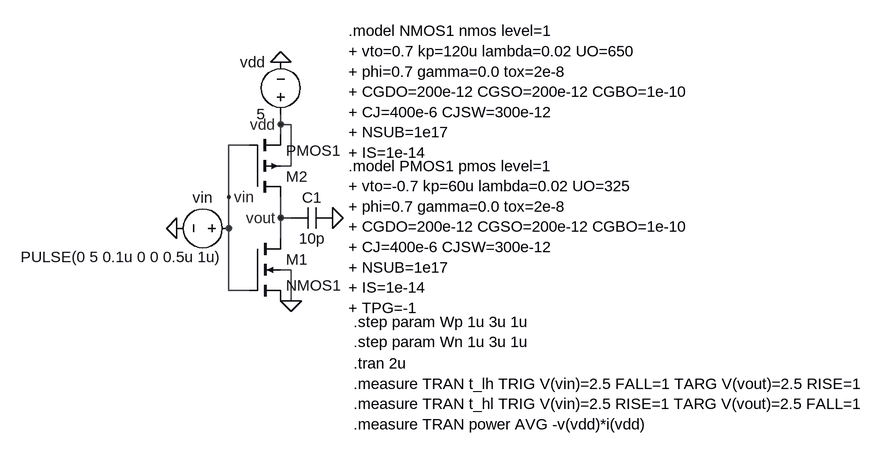
[diagram p0: schematic Draft7.asc]
Draft7.asc, the LTspice schematic file:
Version 4.1
SHEET 1 1180 680
WIRE 224 48 224 32
WIRE 240 48 224 48
WIRE 224 64 224 48
WIRE 176 80 144 80
WIRE 240 112 240 48
WIRE 240 112 224 112
WIRE 144 160 144 80
WIRE 224 192 224 160
WIRE 240 192 224 192
WIRE 144 208 144 160
WIRE 224 224 224 192
WIRE 240 272 224 272
WIRE 144 304 144 208
WIRE 176 304 144 304
WIRE 240 320 240 272
WIRE 240 320 224 320
FLAG 304 192 0
FLAG 64 208 0
FLAG 224 -48 0
FLAG 240 320 0
FLAG 224 48 vdd
FLAG 144 160 vin
FLAG 224 192 vout
SYMBOL pmos4 176 160 M180
SYMATTR InstName M2
SYMATTR Value PMOS1
SYMATTR Value2 l=1u w={Wp}
SYMBOL nmos4 176 224 R0
SYMATTR InstName M1
SYMATTR Value NMOS1
SYMATTR Value2 l=1u w={Wn}
SYMBOL voltage 224 48 R180
WINDOW 0 24 96 Left 2
WINDOW 3 24 16 Left 2
SYMATTR InstName vdd
SYMATTR Value 5
SYMBOL voltage 160 208 R90
WINDOW 0 -32 56 VBottom 2
WINDOW 3 60 181 VBottom 2
WINDOW 123 0 0 Left 0
WINDOW 39 0 0 Left 0
SYMATTR InstName vin
SYMATTR Value PULSE(0 5 0.1u 0 0 0.5u 1u)
SYMBOL cap 304 176 R90
WINDOW 0 0 32 VBottom 2
WINDOW 3 32 32 VTop 2
SYMATTR InstName C1
SYMATTR Value 10p
TEXT 328 -96 Left 2 !.model NMOS1 nmos level=1\n+ vto=0.7 kp=120u lambda=0.02 UO=650\n+ phi=0.7 gamma=0.0 tox=2e-8\n+ CGDO=200e-12 CGSO=200e-12 CGBO=1e-10\n+ CJ=400e-6 CJSW=300e-12\n+ NSUB=1e17\n+ IS=1e-14
TEXT 328 112 Left 2 !.model PMOS1 pmos level=1\n+ vto=-0.7 kp=60u lambda=0.02 UO=325\n+ phi=0.7 gamma=0.0 tox=2e-8\n+ CGDO=200e-12 CGSO=200e-12 CGBO=1e-10\n+ CJ=400e-6 CJSW=300e-12\n+ NSUB=1e17\n+ IS=1e-14\n+ TPG=-1
TEXT 336 352 Left 2 !.step param Wp 1u 3u 1u\n.step param Wn 1u 3u 1u
TEXT 336 416 Left 2 !.tran 2u\n.measure TRAN t_lh TRIG V(vin)=2.5 FALL=1 TARG V(vout)=2.5 RISE=1\n.measure TRAN t_hl TRIG V(vin)=2.5 RISE=1 TARG V(vout)=2.5 FALL=1\n.measure TRAN power AVG -v(vdd)*i(vdd)

The netlist it stands for:
* Draft7.asc
M2 vout vin vdd vdd PMOS1 l=1u w={Wp}
M1 vout vin 0 0 NMOS1 l=1u w={Wn}
vdd vdd 0 5
vin vin 0 PULSE(0 5 0.1u 0 0 0.5u 1u)
C1 0 vout 10p
.model NMOS NMOS
.model PMOS PMOS
.lib standard.mos
.model NMOS1 nmos level=1
+ vto=0.7 kp=120u lambda=0.02 UO=650
+ phi=0.7 gamma=0.0 tox=2e-8
+ CGDO=200e-12 CGSO=200e-12 CGBO=1e-10
+ CJ=400e-6 CJSW=300e-12
+ NSUB=1e17
+ IS=1e-14
.model PMOS1 pmos level=1
+ vto=-0.7 kp=60u lambda=0.02 UO=325
+ phi=0.7 gamma=0.0 tox=2e-8
+ CGDO=200e-12 CGSO=200e-12 CGBO=1e-10
+ CJ=400e-6 CJSW=300e-12
+ NSUB=1e17
+ IS=1e-14
+ TPG=-1
.step param Wp 1u 3u 1u
.step param Wn 1u 3u 1u
.tran 2u
.measure TRAN t_lh TRIG V(vin)=2.5 FALL=1 TARG V(vout)=2.5 RISE=1
.measure TRAN t_hl TRIG V(vin)=2.5 RISE=1 TARG V(vout)=2.5 FALL=1
.measure TRAN power AVG -v(vdd)*i(vdd)
.backanno
.end